# Altium schematic sheet Sheet3.SchDoc
size A4
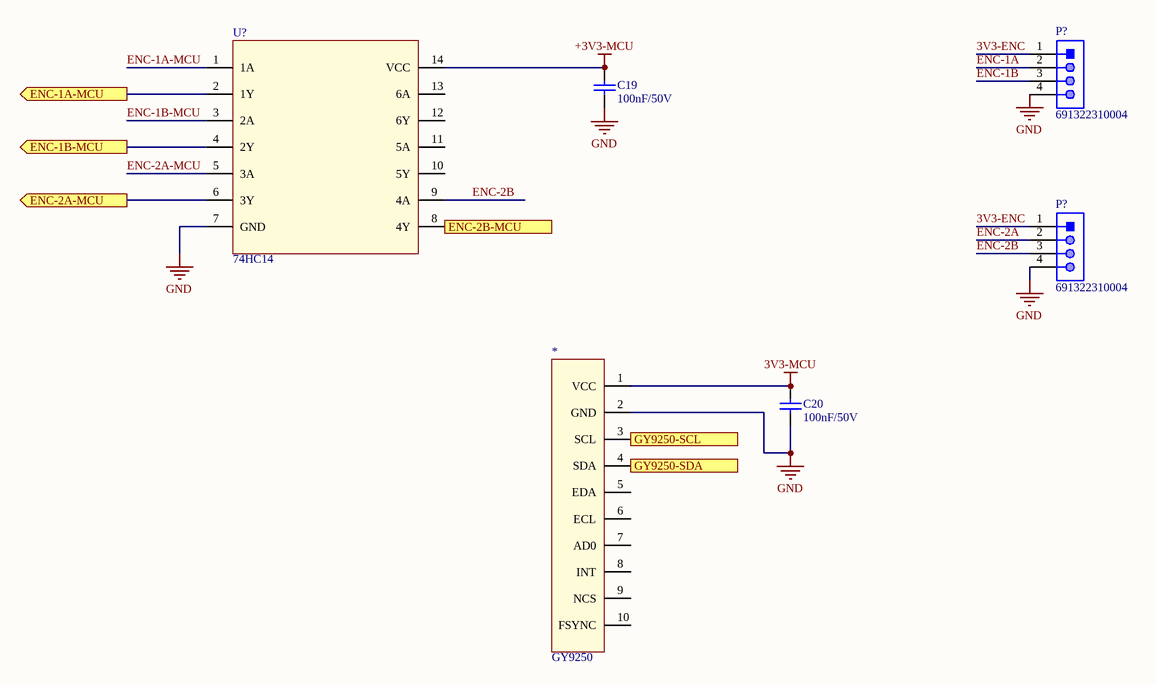
[diagram p0: Sheet3.SchDoc]

## Parts
(Parts that share a designator on the sheet are numbered #1, #2 ... from top to bottom, then left to right.)
*  GY9250
C19  value 100nF/50V  [CAP-SM-0805]  (hidden comment: Cap-100nF-50V-0805)
C20  value 100nF/50V  [CAP-SM-0805]  (hidden comment: Cap-100nF-50V-0805)
P?#1  691322310004  [691322310004]
P?#2  691322310004  [691322310004]
U?  74HC14

## Ports
ENC-1A-MCU (out), ENC-1B-MCU (out), ENC-2A-MCU (out), ENC-2B-MCU (out), GY9250-SCL (in), GY9250-SDA (in)

## Nets
3V3-MCU: *.1(VCC) C20.2
+3V3-MCU: C19.2 U?.14(VCC)
GND: *.2(GND) C19.1 C20.1 P?#1.4 P?#2.4 U?.7(GND)
3V3-ENC: P?#1.1 P?#2.1
ENC-1A: P?#1.2
ENC-1A-MCU: U?.1(1A)
ENC-1A-MCU: U?.2(1Y) ; port ENC-1A-MCU  [a separate net that carries the same name]
ENC-1B: P?#1.3
ENC-1B-MCU: U?.3(2A)
ENC-1B-MCU: U?.4(2Y) ; port ENC-1B-MCU  [a separate net that carries the same name]
ENC-2A: P?#2.2
ENC-2A-MCU: U?.5(3A)
ENC-2A-MCU: U?.6(3Y) ; port ENC-2A-MCU  [a separate net that carries the same name]
ENC-2B: P?#2.3 U?.9(4A)
ENC-2B-MCU: U?.8(4Y) ; port ENC-2B-MCU
GY9250-SCL: *.3(SCL) ; port GY9250-SCL
GY9250-SDA: *.4(SDA) ; port GY9250-SDA

Not connected (* = marked no-connect by the designer): * 5(EDA) 6(ECL) 7(AD0) 8(INT) 9(NCS) 10(FSYNC); U? 10(5Y) 11(5A) 12(6Y) 13(6A)

## Library data of the parts
C19 C20 = Cap-100nF-50V-0805: CAP CER 0.1UF 50V Y5V 0805; Manufacturer: Samsung Electro-Mechanics; Manufacturer Part Number: CL21F104ZBCNNNC; Local Supplier: thegioiic; Local Supplier Link: https://thegioiic.com/products/tu-100nf-0-1uf-50v-0805; Supplier 1: Digikey; Supplier 1 Part Number: 1276-1007-1-ND; Supplier 1 Link: https://www.digikey.com/product-detail/en/samsung-electro-mechanics/CL21F104ZBCNNNC/1276-1007-1-ND/3889093
P?#1 P?#2 = 691322310004: WR-TBL Serie 322 Horizontal PCB Header, Pluggable, pitch 3.81mm, 4p; Compliance: RoHS; Modularity: No; Pin Number: 4; Rated Current [UL]: 10A; Working Voltage [UL]: 300VAC; ComponentLink1Description: Manufacturer; ComponentLink1URL: http://www.we-online.de; ComponentLink2URL: https://katalog.we-online.de/em/datasheet/691322310004.pdf; ComponentLink2Description: Datasheet; Mounting Technology: THT; Part Number: 691322310004; Packaging: Box; Operating Temperature: -40 to +105degC; PCB/Cable/Panel: PCB; Pitch: 3.81mm; Published Date: October 2019; Type: Horizontal; Publisher: Wurth Elektronik; Application: Pluggable